# EAGLE design board_A500_A4000_CD32 (EAGLE 9.5.1)
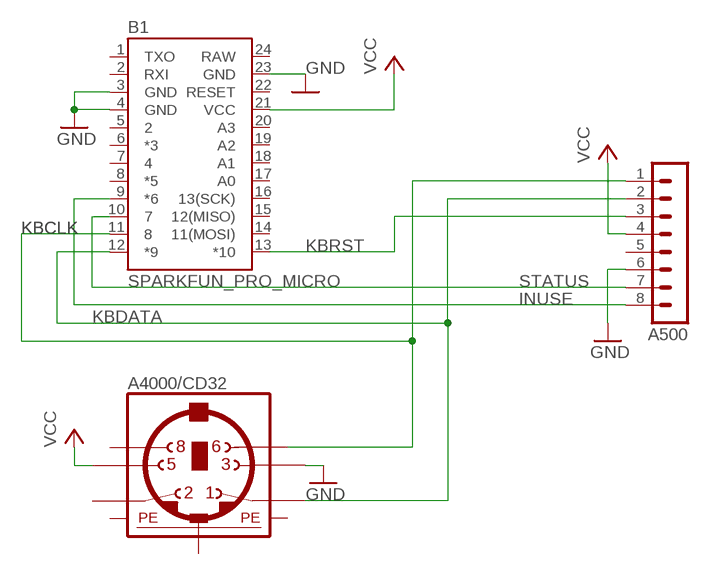
[diagram p0: schematic, sheet 1]

## Parts
A500  MA08-1  [MA08-1]
A4000/CD32  MINI_DIN_6  [M_DIN6]
B1  SPARKFUN_PRO_MICRO  [SPARKFUN_PRO_MICRO]

## Nets
GND: A500.6 A4000/CD32.3 B1.3(GND) B1.4(GND) B1.23(GND)
INUSE: A500.8 B1.9(*6)
KBCLK: A500.1 A4000/CD32.6 B1.11
KBDATA: A500.2 A4000/CD32.1 B1.12(*9)
KBRST: A500.3 B1.13(*10)
STATUS: A500.7 B1.10
VCC: A500.4 A4000/CD32.5 B1.21(VCC)
Unconnected: A500.5 A4000/CD32.2 A4000/CD32.8 B1.1(TXO) B1.2(RXI) B1.5 B1.6(*3) B1.7 B1.8(*5) B1.14(11(MOSI)) B1.15(12(MISO)) B1.16(13(SCK)) B1.17(A0) B1.18(A1) B1.19(A2) B1.20(A3) B1.22(RESET)

## Power pins joined to a net without a drawn wire
PE1: A4000/CD32.SH1(PE1)
PE2: A4000/CD32.SH2(PE2)
PE3: A4000/CD32.SH3(PE3)
RAW: B1.24(RAW)

## Library data of the parts
A500 = con-lstb:MA08-1: PIN HEADER; OC_FARNELL: unknown; OC_NEWARK: unknown
A4000/CD32 = mini_din:MINI_DIN_6
B1 = SparkFun-Boards:SPARKFUN_PRO_MICRO: SparkFun Pro Micro Atmega32U4 compatible footprint. SparkFun Products: 3.3V/8MHz <https://www.sparkfun.com/products/12587> 5V/16MHz <https://www.sparkfun.com/products/12640>

## Board
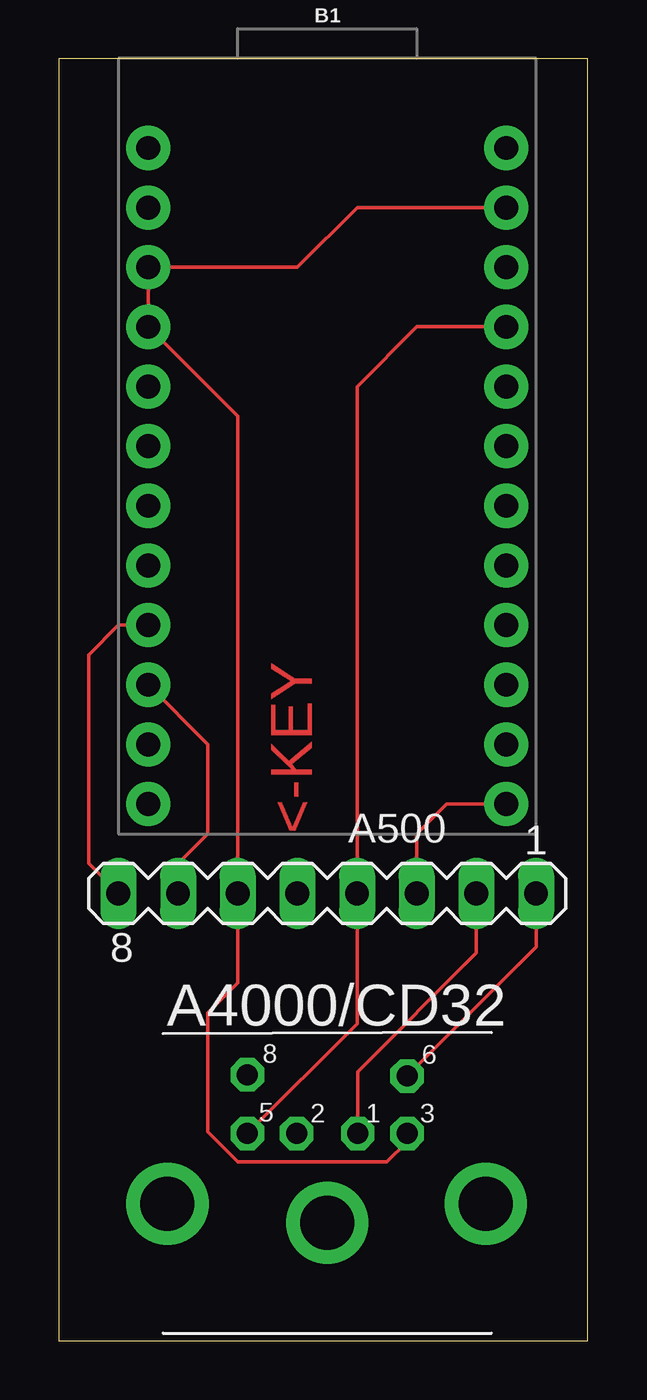
[diagram p1: board, top side]
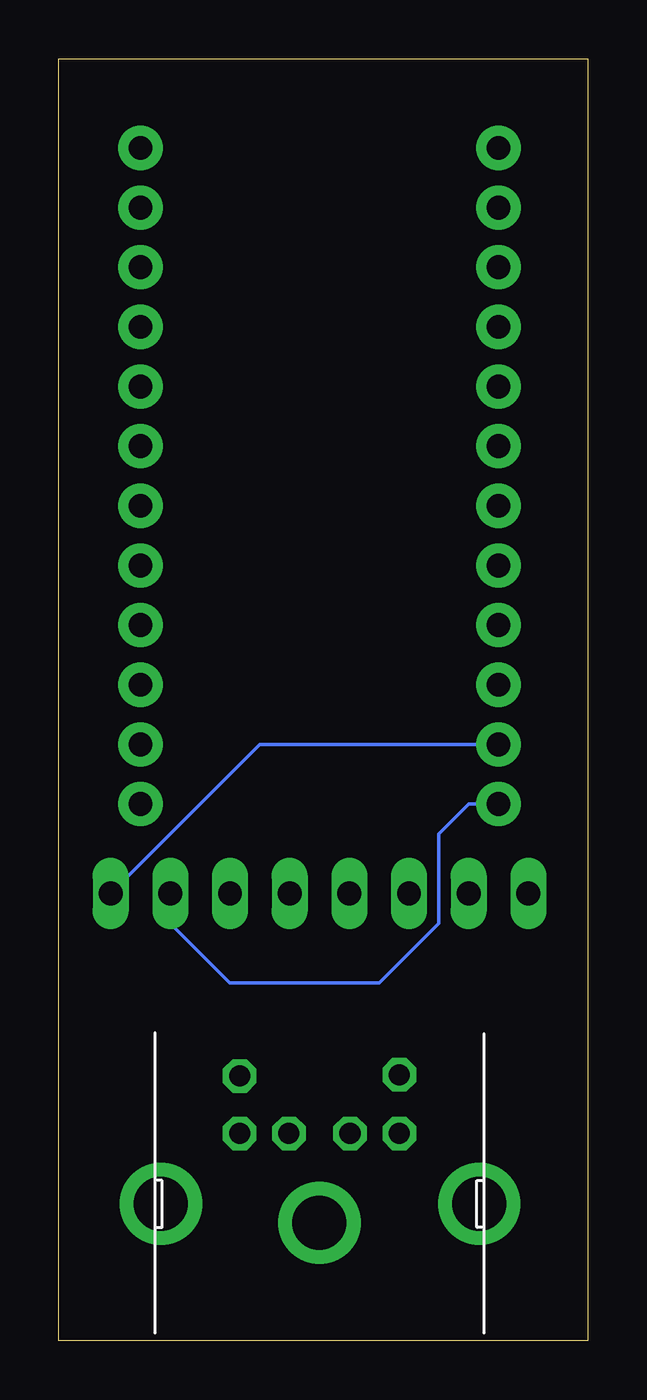
[diagram p2: board, bottom side, seen from below]

Size 22.53 x 54.6 mm. Coordinates in mm from the lower left corner, seen from the top.
Outline: 0,0 22.53,0 22.53,54.6 0,54.6 0,0
Copper layers (1*16): Top 0.035mm / dielectric 1.5mm / Bottom 0.035mm
Design rules "default": minimum track width 6mil, minimum drill 0.35mm, track to track 6mil, track to pad 6mil, pad to pad 6mil, via to via 6mil, smd to smd 6mil, copper to edge 40mil, drill to drill 6mil, minimum pad ring 10mil, minimum via ring 8mil, stop-mask expansion 4mil, vias tented up to drill 0mil, thermal gap 10mil

### Footprints (pad centres in the part's own frame; a part is rotated, then mirrored left to right if it is on the bottom)
MA08-1 = drill 1.016 long: 1 -8.89,0; 2 -6.35,0; 3 -3.81,0; 4 -1.27,0; 5 1.27,0; 6 3.81,0; 7 6.35,0; 8 8.89,0
M_DIN6 = drill 0.9 pad 1.422 octagon: 1 -1.3,-3.75; 2 1.3,-3.75; 3 -3.4,-3.75; 5 3.4,-3.75; 6 -3.4,-6.2; 8 3.4,-6.25 | drill 2.3 pad 3.5: SH1 6.8,-0.75; SH2 0,0.05; SH3 -6.75,-0.75
SPARKFUN_PRO_MICRO = drill 1.016 pad 1.88: 1 -7.62,12.7; 2 -7.62,10.16; 3 -7.62,7.62; 4 -7.62,5.08; 5 -7.62,2.54; 6 -7.62,0; 7 -7.62,-2.54; 8 -7.62,-5.08; 9 -7.62,-7.62; 10 -7.62,-10.16; 11 -7.62,-12.7; 12 -7.62,-15.24; 13 7.62,-15.24; 14 7.62,-12.7; 15 7.62,-10.16; 16 7.62,-7.62; 17 7.62,-5.08; 18 7.62,-2.54; 19 7.62,0; 20 7.62,2.54; 21 7.62,5.08; 22 7.62,7.62; 23 7.62,10.16; 24 7.62,12.7

### Placement (x,y rotation side)
A500  11.43,19.05 180 top
A4000/CD32  11.43,5.08 180 top
B1  11.43,38.1 0 top

### Tracks (layer width: path | path; a pad name or v marks a point on that pad's centre or on a via)
GND
  Top 0.152: B1.23 12.7,48.26 10.16,45.72 B1.3 B1.4 7.62,39.37 A500.6 7.62,15.24 6.35,13.97 6.35,8.89 7.62,7.62 13.97,7.62 14.83,8.48 A4000/CD32.3
INUSE
  Top 0.152: B1.9 2.54,30.48 1.27,29.21 1.27,20.32 A500.8
KBCLK
  Top 0.152: A4000/CD32.6 20.32,16.77 A500.1
  Bottom 0.152: B1.11 13.97,25.4 A500.1
KBDATA
  Top 0.152: A4000/CD32.1 12.73,11.46 17.78,16.51 A500.2
  Bottom 0.152: B1.12 5.08,22.86 6.35,21.59 6.35,17.78 8.89,15.24 15.24,15.24 17.78,17.78 A500.2
KBRST
  Top 0.152: A500.3 15.24,21.59 16.51,22.86 B1.13
STATUS
  Top 0.152: A500.7 5.08,20.32 6.35,21.59 6.35,25.4 B1.10
VCC
  Top 0.152: B1.21 15.24,43.18 12.7,40.64 A500.4 12.7,13.5 A4000/CD32.5

### Text on the board
Top: <-KEY